# EAGLE schematic msp432-standard-feather (EAGLE 9.5.2)
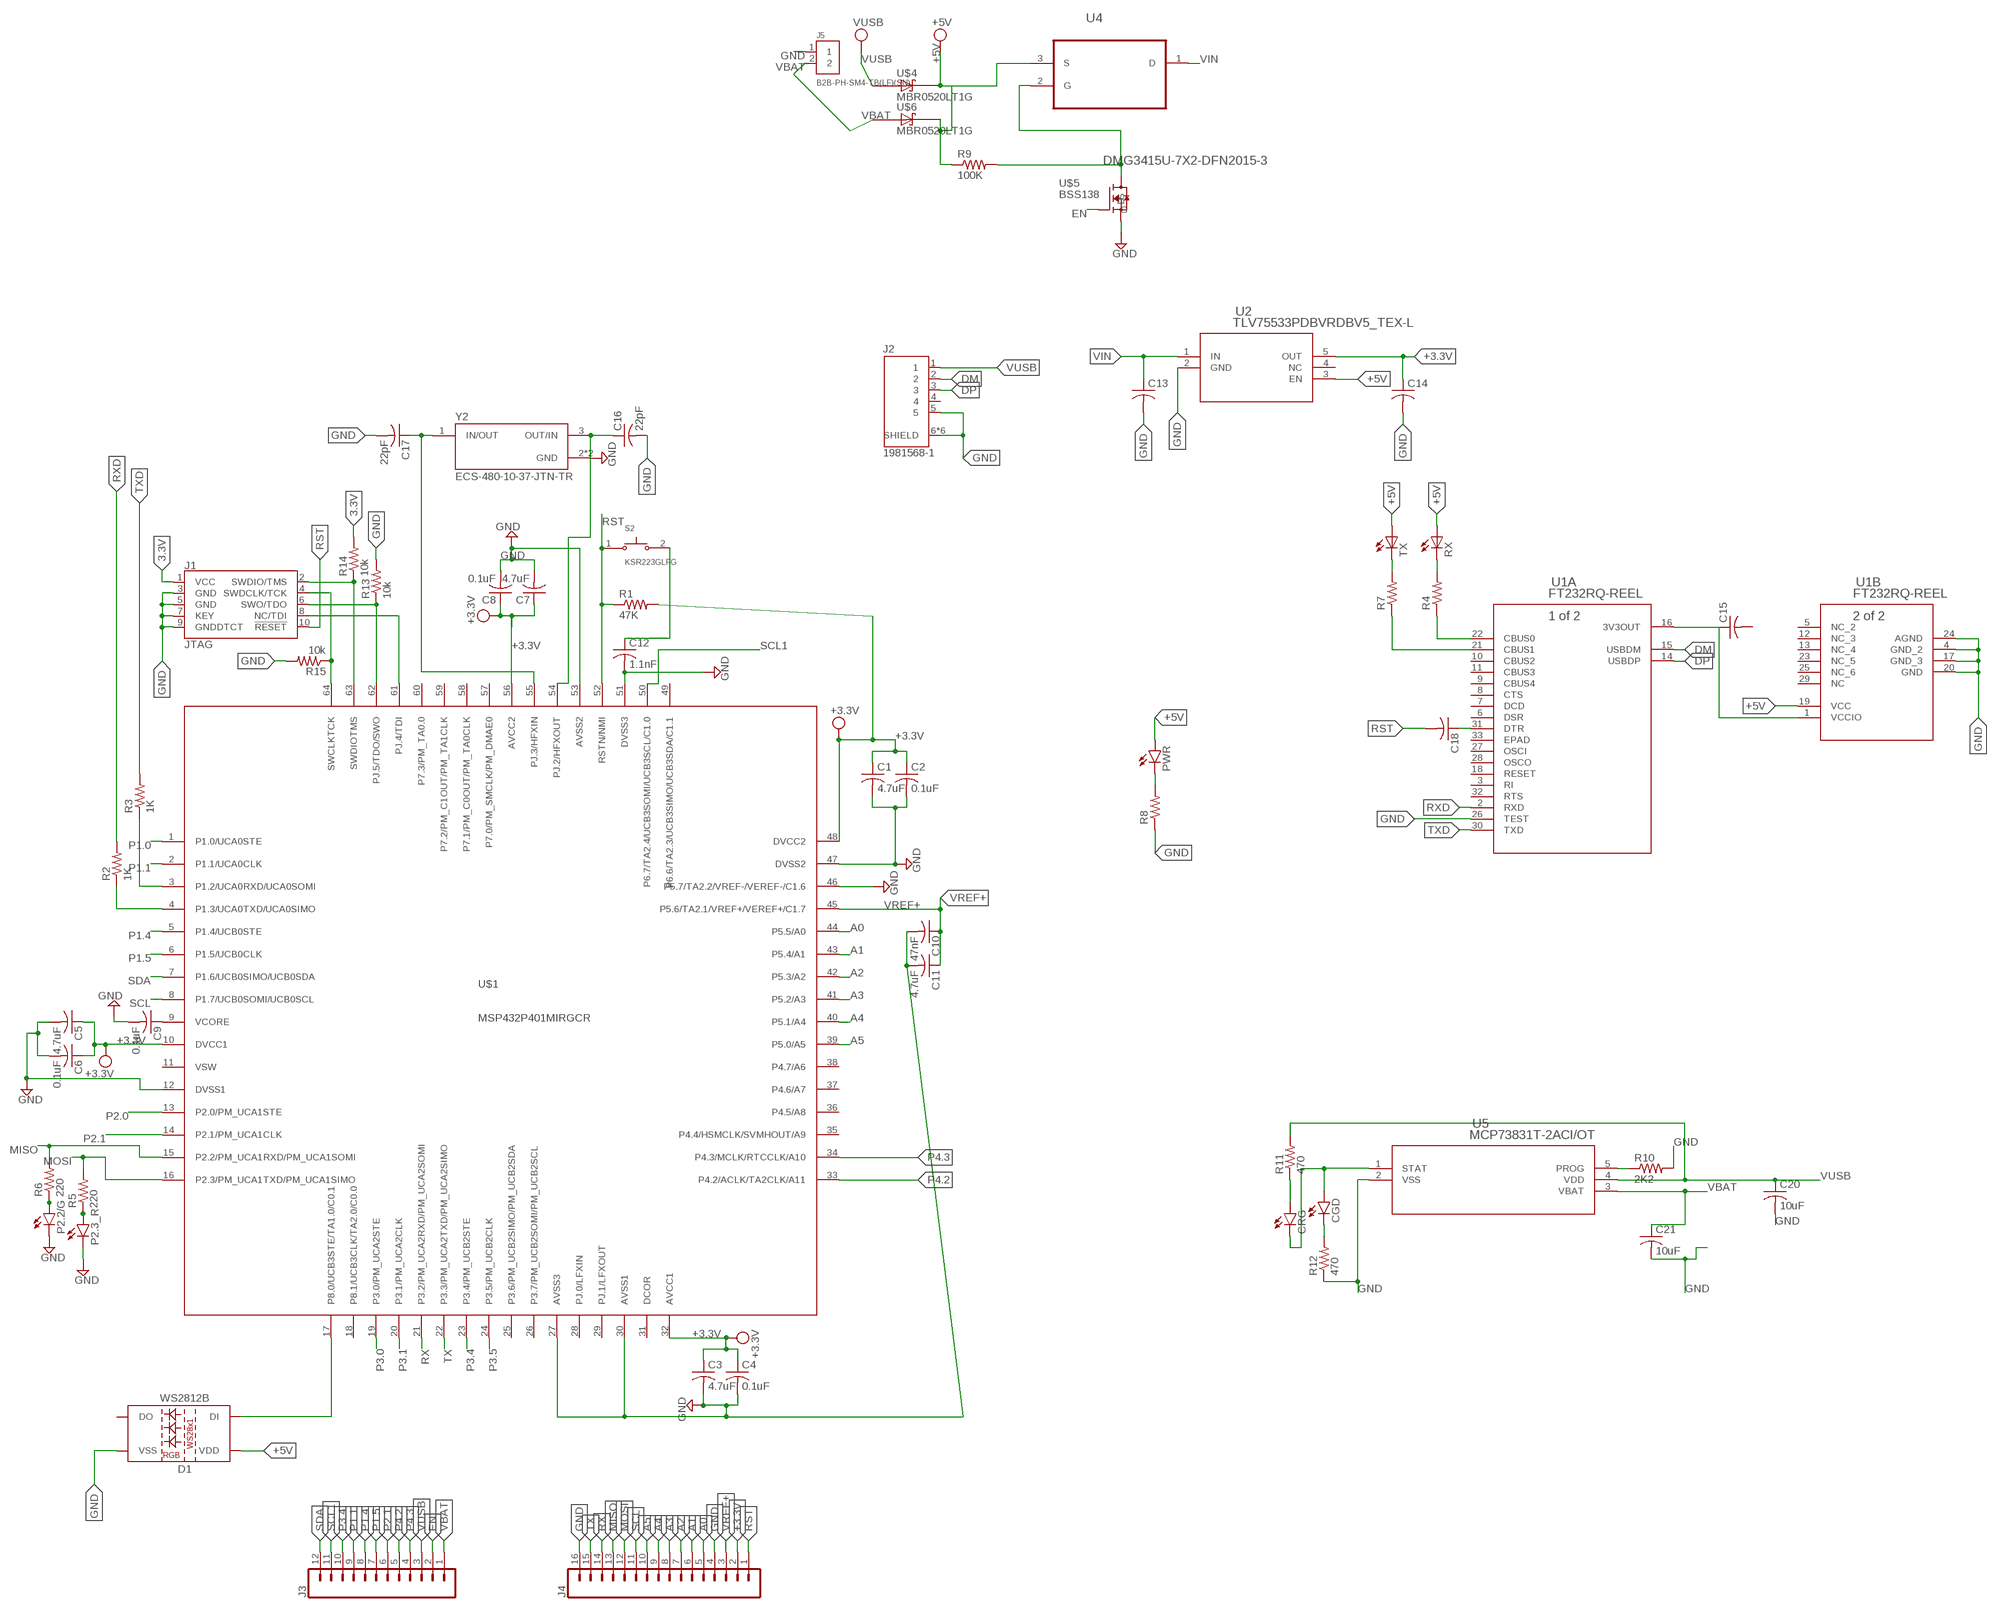
[diagram p0: schematic, sheet 1]

## Parts
C1  4.7uF  C-USC0603  [C0603]
C2  0.1uF  C-USC0402  [C0402]
C3  4.7uF  C-USC0603  [C0603]
C4  0.1uF  C-USC0402  [C0402]
C5  4.7uF  C-USC0603  [C0603]
C6  0.1uF  C-USC0402  [C0402]
C7  4.7uF  C-USC0603  [C0603]
C8  0.1uF  C-USC0402  [C0402]
C9  0.1uF  C-USC0402  [C0402]
C10  47nF  C-USC0402  [C0402]
C11  4.7uF  C-USC0603  [C0603]
C12  1.1nF  C-USC0402  [C0402]
C13  C-USC0402  [C0402]
C14  C-USC0402  [C0402]
C15  C-USC0402  [C0402]
C16  22pF  C-USC0402  [C0402]
C17  22pF  C-USC0402  [C0402]
C18  C-USC0402  [C0402]
C20  10uF  C-USC0603  [C0603]
C21  10uF  C-USC0603  [C0603]
CGD  LEDCHIP-LED0603  [CHIP-LED0603]
CRG  LEDCHIP-LED0603  [CHIP-LED0603]
D1  WS2812B  [WS2812B]
J1  JTAG  CORTEX_JTAG_DEBUG_SMD  [2X5-SMD-1.27MM]
J2  1981568-1  [TE_1981568-1]
J3  CONN_12NO_SILK  [1X12_NO_SILK]
J4  CONN_161X16_NO_SILK  [1X16_NO_SILK]
J5  B2B-PH-SM4-TB(LF)(SN)  [JST_B2B-PH-SM4-TB(LF)(SN)]
P2.2/G  LEDCHIP-LED0603  [CHIP-LED0603]
P2.3_R  LEDCHIP-LED0603  [CHIP-LED0603]
PWR  LEDCHIP-LED0603  [CHIP-LED0603]
R1  47K  R-US_R0402  [R0402]
R2  1K  R-US_R0402  [R0402]
R3  1K  R-US_R0402  [R0402]
R4  R-US_R0402  [R0402]
R5  220  R-US_R0402  [R0402]
R6  220  R-US_R0402  [R0402]
R7  R-US_R0402  [R0402]
R8  R-US_R0402  [R0402]
R9  100K  R-US_R0402  [R0402]
R10  2K2  R-US_R0402  [R0402]
R11  470  R-US_R0402  [R0402]
R12  470  R-US_R0402  [R0402]
R13  10k  R-US_R0402  [R0402]
R14  10k  R-US_R0402  [R0402]
R15  10k  R-US_R0402  [R0402]
RX  LEDCHIP-LED0603  [CHIP-LED0603]
S2  KSR223GLFG  [SW_KSR223GLFG]
TX  LEDCHIP-LED0603  [CHIP-LED0603]
U1  FT232RQ-REEL  [FT232RQ-REEL_FTD]
U2  TLV75533PDBVRDBV5_TEX-L  [DBV5_TEX-L]
U4  DMG3415U-7X2-DFN2015-3  [X2-DFN2015-3]
U5  MCP73831T-2ACI/OT  [SOT-23-5_MC]
U$1  MSP432P401MIRGCR  [MSP432_QFN_64]
U$4  MBR0520LT1G  [SOD3716X117(SOD-123)]
U$5  BSS138  [BSS138]
U$6  MBR0520LT1G  [SOD3716X117(SOD-123)]
Y2  ECS-480-10-37-JTN-TR  [XTAL_ECS-480-10-37-JTN-TR]

## Nets
3.3V: J1.1(VCC) R14.2
+3.3V [PWR]: C1.1 C2.1 C3.1 C4.1 C5.1 C6.1 C7.1 C8.1 C14.1 J4.2 R1.2 U2.5(OUT) U$1.10(DVCC1) U$1.32(AVCC1) U$1.48(DVCC2) U$1.56(AVCC2)
+5V: D1.1(VDD) PWR.A R9.1 RX.A TX.A U1.19(B:VCC) U2.3(EN) U4.3(S) U$4.1(C) U$6.1(C)
A0 [analog]: J4.5 U$1.44(P5.5/A0)
A1 [analog]: J4.6 U$1.43(P5.4/A1)
A2 [analog]: J4.7 U$1.42(P5.3/A2)
A3 [analog]: J4.8 U$1.41(P5.2/A3)
A4 [analog]: J4.9 U$1.40(P5.1/A4)
A5 [analog]: J4.10 U$1.39(P5.0/A5)
DM: J2.2 U1.15(A:USBDM)
DP: J2.3 U1.14(A:USBDP)
EN: J3.2 U$5.G
GND [PWR]: C1.2 C2.2 C3.2 C4.2 C5.2 C6.2 C7.2 C8.2 C9.2 C10.2 C11.2 C12.2 C13.2 C14.2 C16.2 C17.2 C20.2 C21.2 D1.3(VSS) J1.3(GND) J1.5(GND) J1.7(KEY) J1.9(GNDDTCT) J2.5 J2.6(SHIELD) J2.7(SHIELD) J2.8(SHIELD) J2.9(SHIELD) J2.10(SHIELD) J2.11(SHIELD) J4.4 J4.16 J5.1 P2.2/G.C P2.3_R.C R8.1 R10.2 R12.1 R13.2 R15.2 U1.4(B:GND_2) U1.17(B:GND_3) U1.20(B:GND) U1.24(B:AGND) U1.26(A:TEST) U2.2(GND) U5.2(VSS) U$1.12(DVSS1) U$1.27(AVSS3) U$1.30(AVSS1) U$1.46(P5.7/TA2.2/VREF-/VEREF-/C1.6) U$1.47(DVSS2) U$1.51(DVSS3) U$1.53(AVSS2) U$5.S Y2.2(GND) Y2.4(GND)
MISO [digital]: J4.13 R6.2 U$1.15(P2.2/PM_UCA1RXD/PM_UCA1SOMI)
MOSI [digital]: J4.12 R5.2 U$1.16(P2.3/PM_UCA1TXD/PM_UCA1SIMO)
N$1: C9.1 U$1.9(VCORE)
N$2: R10.1 U5.5(PROG)
N$3: C15.1 U1.1(B:VCCIO) U1.16(A:3V3OUT)
N$4: C18.1 U1.31(A:DTR)
N$5: R7.1 U1.21(A:CBUS1)
N$6: R4.1 U1.22(A:CBUS0)
N$7: R4.2 RX.C
N$8: R7.2 TX.C
N$9: J1.4(SWDCLK/TCK) R15.1 U$1.64(SWCLKTCK)
N$10: C12.1 S2.2
N$11: J1.2(SWDIO/TMS) R14.1 U$1.63(SWDIOTMS)
N$12: PWR.C R8.2
N$13: P2.2/G.A R6.1
N$14: R2.1 U$1.4(P1.3/UCA0TXD/UCA0SIMO)
N$15: R3.1 U$1.3(P1.2/UCA0RXD/UCA0SOMI)
N$16: J1.6(SWO/TDO) R13.1 U$1.62(PJ.5/TDO/SWO)
N$17: R9.2 U4.2(G) U$5.D
N$18: CGD.A CRG.C U5.1(STAT)
N$19: J1.8(NC/TDI) U$1.61(PJ.4/TDI)
N$20: D1.4(DI) U$1.17(P8.0/UCB3STE/TA1.0/C0.1)
N$24: CGD.C R12.2
N$25: CRG.A R11.1
N$42: P2.3_R.A R5.1
N$47: C16.1 U$1.54(PJ.2/HFXOUT) Y2.3(OUT/IN)
N$48: C17.1 U$1.55(PJ.3/HFXIN) Y2.1(IN/OUT)
P1.0 [digital]: U$1.1(P1.0/UCA0STE)
P1.1 [digital]: J3.9 U$1.2(P1.1/UCA0CLK)
P1.4 [digital]: J3.8 U$1.5(P1.4/UCB0STE)
P1.5 [digital]: J3.7 U$1.6(P1.5/UCB0CLK)
P2.0: U$1.13(P2.0/PM_UCA1STE)
P2.1 [digital]: J3.6 U$1.14(P2.1/PM_UCA1CLK)
P3.0: U$1.19(P3.0/PM_UCA2STE)
P3.1: U$1.20(P3.1/PM_UCA2CLK)
P3.4 [digital]: J3.10 U$1.23(P3.4/PM_UCB2STE)
P3.5 [digital]: U$1.24(P3.5/PM_UCB2CLK)
P4.2: J3.5 U$1.33(P4.2/ACLK/TA2CLK/A11)
P4.3: J3.4 U$1.34(P4.3/MCLK/RTCCLK/A10)
RST: C18.2 J1.10(!RESET) J4.1 R1.1 S2.1 U$1.52(RSTN/NMI)
RX [digital]: J4.14 U$1.21(P3.2/PM_UCA2RXD/PM_UCA2SOMI)
RXD: R2.2 U1.2(A:RXD)
SCL [analog]: J4.11 U$1.8(P1.7/UCB0SOMI/UCB0SCL)
SCL1 [analog]: J3.11 U$1.50(P6.7/TA2.4/UCB3SOMI/UCB3SCL/C1.0)
SDA [analog]: J3.12 U$1.7(P1.6/UCB0SIMO/UCB0SDA)
TX [digital]: J4.15 U$1.22(P3.3/PM_UCA2TXD/PM_UCA2SIMO)
TXD: R3.2 U1.30(A:TXD)
VBAT [PWR]: C21.1 J3.1 J5.2 U5.3(VBAT) U$6.2(A)
VIN [PWR]: C13.1 U2.1(IN) U4.1(D)
VREF+ [analog]: C10.1 C11.1 J4.3 U$1.45(P5.6/TA2.1/VREF+/VEREF+/C1.7)
VUSB [PWR]: C20.1 J2.1 J3.3 R11.2 U5.4(VDD) U$4.2(A)
Unconnected: C15.2 D1.2(DO) J2.4 U1.3(A:RI) U1.5(B:NC_2) U1.6(A:DSR) U1.7(A:DCD) U1.8(A:CTS) U1.9(A:CBUS4) U1.10(A:CBUS2) U1.11(A:CBUS3) U1.12(B:NC_3) U1.13(B:NC_4) U1.18(A:RESET) U1.23(B:NC_5) U1.25(B:NC_6) U1.27(A:OSCI) U1.28(A:OSCO) U1.29(B:NC) U1.32(A:RTS) U1.33(A:EPAD) U2.4(NC) U$1.11(VSW) U$1.18(P8.1/UCB3CLK/TA2.0/C0.0) U$1.25(P3.6/PM_UCB2SIMO/PM_UCB2SDA) U$1.26(P3.7/PM_UCB2SOMI/PM_UCB2SCL) U$1.28(PJ.0/LFXIN) U$1.29(PJ.1/LFXOUT) U$1.31(DCOR) U$1.35(P4.4/HSMCLK/SVMHOUT/A9) U$1.36(P4.5/A8) U$1.37(P4.6/A7) U$1.38(P4.7/A6) U$1.49(P6.6/TA2.3/UCB3SIMO/UCB3SDA/C1.1) U$1.57(P7.0/PM_SMCLK/PM_DMAE0) U$1.58(P7.1/PM_C0OUT/PM_TA0CLK) U$1.59(P7.2/PM_C1OUT/PM_TA1CLK) U$1.60(P7.3/PM_TA0.0)

## Library data of the parts
C1-C18 C20 C21 = rcl:C-US: CAPACITOR, American symbol; SPICEPREFIX: C
CGD CRG P2.2/G P2.3_R PWR = led:LED: LED
D1 = SparkFun-LED:WS2812B: WS2812B SMD addressable RGB LED 5x5mm SMD LED with built-in controller IC. Color: Red/Green/Blue mC Rating: RGB: 390, 660, 180 mcd Forward Voltage: RGB: 2.0, 3.0, 3.0 V Packages:WS2812B SparkFun Products: Blynk Board - ESP8266 <https://www.sparkfun.com/products/13794>; PROD_ID: DIO-12503
J1 = SparkFun-Connectors:CORTEX_JTAG_DEBUG: Cortex Debug Connector - 10 pin Supports JTAG debug, Serial Wire debug, and Serial Wire Viewer. PTH and SMD connector options available. General Connector Information <http://infocenter.arm.com/help/topic/com.arm.doc.faqs/attached/13634/cortex_debug_connectors.pdf> Products: PTH Connector <http://www.digikey.com/product-detail/en/cnc-tech/3220-10-0100-00/1175-1627-ND/3883661> -via Digi-Key SparkFun PSoc <https://www.sparkfun.com/products/13229> SparkFun T <https://www.sparkfun.com/products/13810>; PROD_ID: CONN-14503
J2 = 1981568-1:1981568-1: CONN RCPT MICRO USB B R/A SMD; AVAILABILITY: Unavailable; DESCRIPTION: USB - micro B USB 2.0 Receptacle Connector 5 Position Surface Mount, Right Angle; MF: TE Connectivity; MP: 19815681; PACKAGE: None; PRICE: None; TE_PURCHASE_URL: https://www.te.com/usa-en/product-19815681.html?te_bu=Cor&te_type=disp&te_campaign=seda_glo_cor-seda-global-disp-prtnr-fy19-seda-model-bom-cta_sma-317_1&elqCampaignId=32493
J3 = SparkFun-Connectors:CONN_12: Multi connection point. Often used as Generic Header-pin footprint for 0.1 inch spaced/style header connections On any of the 0.1 inch spaced packages, you can populate with these: Break Away Headers - Straight <https://www.sparkfun.com/products/116> (PRT-00116) Break Away Male Headers - Right Angle <https://www.sparkfun.com/products/553> (PRT-00553) Female Headers <https://www.sparkfun.com/products/115> (PRT-00115) Break Away Headers - Machine Pin <https://www.sparkfun.com/products/117> (PRT-00117) Break Away Female Headers - Swiss Machine Pin <https://www.sparkfun.com/products/743> (PRT-00743) For SCREWTERMINALS and SPRING TERMINALS visit here: Screw Terimnals on SparkFun.com <https://www.sparkfun.com/search/results?term=Screw+Terminals> (5mm/3.5mm/2.54mm spacing) This device is also useful as a general connection point to wire up your design to another part of your project. Our various solder wires solder well into these plated through hole pads. Hook-Up Wire - Assortment (Stranded, 22 AWG) <https://www.sparkfun.com/products/11375> (PRT-11375) Hook-Up Wire - Assortment (Solid Core, 22 AWG) <https://www.sparkfun.com/products/11367> (PRT-11367) View the entire wire category on our website here <https://www.sparkfun.com/categories/141> Special notes: Molex polarized connector foot print use with SKU : PRT-08231 with associated crimp pins and housings. 1MM SMD Version SKU: PRT-10208 NOTES ON THE VARIANTS LOCK and LOCK_LONGPADS... This footprint was designed to help hold the alignment of a through-hole component (i.e. 6-pin header) while soldering it into place. You may notice that each hole has been shifted either up or down by 0.005 of an inch from it's more standard position (which is a perfectly straight line). This slight alteration caused the pins (the squares in the middle) to touch the edges of the holes. Because they are alternating, it causes a "brace" to hold the component in place. 0.005 has proven to be the perfect amount of "off-center" position when using our standard breakaway headers. Although looks a little odd when you look at the bare footprint, once you have a header in there, the alteration is very hard to notice. Also,if you push a header all the way into place, it is covered up entirely on the bottom side.
J4 = SparkFun-Connectors:CONN_16: Multi connection point. Often used as Generic Header-pin footprint for 0.1 inch spaced/style header connections On any of the 0.1 inch spaced packages, you can populate with these: Break Away Headers - Straight <https://www.sparkfun.com/products/116> (PRT-00116) Break Away Male Headers - Right Angle <https://www.sparkfun.com/products/553> (PRT-00553) Female Headers <https://www.sparkfun.com/products/115> (PRT-00115) Break Away Headers - Machine Pin <https://www.sparkfun.com/products/117> (PRT-00117) Break Away Female Headers - Swiss Machine Pin <https://www.sparkfun.com/products/743> (PRT-00743) For SCREWTERMINALS and SPRING TERMINALS visit here: Screw Terimnals on SparkFun.com <https://www.sparkfun.com/search/results?term=Screw+Terminals> (5mm/3.5mm/2.54mm spacing) This device is also useful as a general connection point to wire up your design to another part of your project. Our various solder wires solder well into these plated through hole pads. Hook-Up Wire - Assortment (Stranded, 22 AWG) <https://www.sparkfun.com/products/11375> (PRT-11375) Hook-Up Wire - Assortment (Solid Core, 22 AWG) <https://www.sparkfun.com/products/11367> (PRT-11367) View the entire wire category on our website here <https://www.sparkfun.com/categories/141> Special notes: Molex polarized connector foot print use with SKU : PRT-08231 with associated crimp pins and housings. 1MM SMD Version SKU: PRT-10208 NOTES ON THE VARIANTS LOCK and LOCK_LONGPADS... This footprint was designed to help hold the alignment of a through-hole component (i.e. 6-pin header) while soldering it into place. You may notice that each hole has been shifted either up or down by 0.005 of an inch from it's more standard position (which is a perfectly straight line). This slight alteration caused the pins (the squares in the middle) to touch the edges of the holes. Because they are alternating, it causes a "brace" to hold the component in place. 0.005 has proven to be the perfect amount of "off-center" position when using our standard breakaway headers. Although looks a little odd when you look at the bare footprint, once you have a header in there, the alteration is very hard to notice. Also,if you push a header all the way into place, it is covered up entirely on the bottom side.
J5 = B2B-PH-SM4-TB_LF__SN_:B2B-PH-SM4-TB(LF)(SN): PH Series 2 Position 2 mm Pitch Surface Mount Top Entry Shrouded Header; AVAILABILITY: Unavailable; DESCRIPTION: Connector Header Surface Mount 2 position 0.079 _2.00mm_; MF: JST Sales; MP: B2B-PH-SM4-TB_LF__SN_; PACKAGE: None; PRICE: None
R1-R15 = rcl:R-US_: RESISTOR, American symbol; SPICEPREFIX: R
RX TX = adafruit:LED: LED
S2 = KSR223GLFG:KSR223GLFG: Switch Tactile N.O. SPST Round Button Gull Wing 0.01A 32VDC 0.2VA 200000Cycles 2N SMD Automotive T/R; AVAILABILITY: Unavailable; DESCRIPTION: Tactile Switch SPST-NO Top Actuated Surface Mount; MF: C&K; MP: KSR223GLFG; PACKAGE: None; PRICE: None
U1 = FT232RQ-:FT232RQ-REEL; BUILT_BY: EMA_Colton; COPYRIGHT: Copyright (C) 2018 Accelerated Designs. All rights reserved; DATASHEET: https://datasheet.octopart.com/FT232RQ-REEL-FTDI-datasheet-11992319.pdf; MANUFACTURER_PART_NUMBER: FT232RQ-REEL; SOURCELIBRARY: FTDI_2020-02-06; VENDOR: FTDI
U2 = TLV75533pdbvr:TLV75533PDBVR; COPYRIGHT: Copyright (C) 2018 Accelerated Designs. All rights reserved; MANUFACTURER_PART_NUMBER: TLV75533PDBVR; SOURCELIBRARY: TI_2019-06-18; VENDOR: Texas Instruments
U4 = DMG3415U-7:DMG3415U-7: P-CHANNEL ENHANCEMENT MODE MOSFET
U5 = MCP73831-2ACI:MCP73831T-2ACI/OT; BUILT_BY: EMA_UL_Team; MANUFACTURER_PART_NUMBER: MCP73831T-2ACI/OT; VENDOR: Microchip
U$1 = MSP432P401MIRGCR:MSP432P401MIRGCR; AVAILABILITY: Unavailable; DESCRIPTION: ARM® Cortex®-M4F MSP432™ Microcontroller IC 32-Bit 48MHz 128KB _128K x 8_ FLASH 64-VQFN _9x9_; MF: Texas Instruments; MP: MSP432P401MIRGCR; PACKAGE: VQFN-64 Texas Instruments; PRICE: None
U$4 U$6 = MBR0520LT1G:MBR0520LT1G: Surface Mount Schottky Power Rectifier Plastic SOD−123 Package; AVAILABILITY: Unavailable; DESCRIPTION: Diode Schottky 20V 500mA Surface Mount SOD-123; MF: ON Semiconductor; MP: MBR0520LT1G; PACKAGE: SOD-123 ON Semiconductor; PRICE: None
U$5 = BSS138:BSS138: BSS138 N-Channel Logic Level Enhancement Mode Field Effect Transistor; AVAILABILITY: Unavailable; DESCRIPTION: N-Channel 50V 220mA _Ta_ 360mW _Ta_ Surface Mount Die; MF: MICROSS/On Semiconductor; MP: BSS138; PACKAGE: TO-236-3 Micross; PRICE: None
Y2 = ECS-480-10-37-JTN-TR:ECS-480-10-37-JTN-TR: SMD Crystal 2.0 x 1.6 x 0.45 mm ceramic package; AVAILABILITY: Unavailable; DESCRIPTION: 48MHz ±20ppm Crystal 10pF 50 Ohms 4-SMD, No Lead; MF: ECS Inc.; MP: ECS-480-10-37-JTN-TR; PACKAGE: SMD-4 ECS International; PRICE: None

## Net classes
0 default: width 0.152 mm, clearance 0.127 mm
1 PWR: width 0.152 mm, clearance 0.127 mm
2 analog: width 0.152 mm, clearance 0.152 mm
3 digital: width 0.152 mm, clearance 0.152 mm